# EAGLE design usbio (EAGLE 9.3.0)
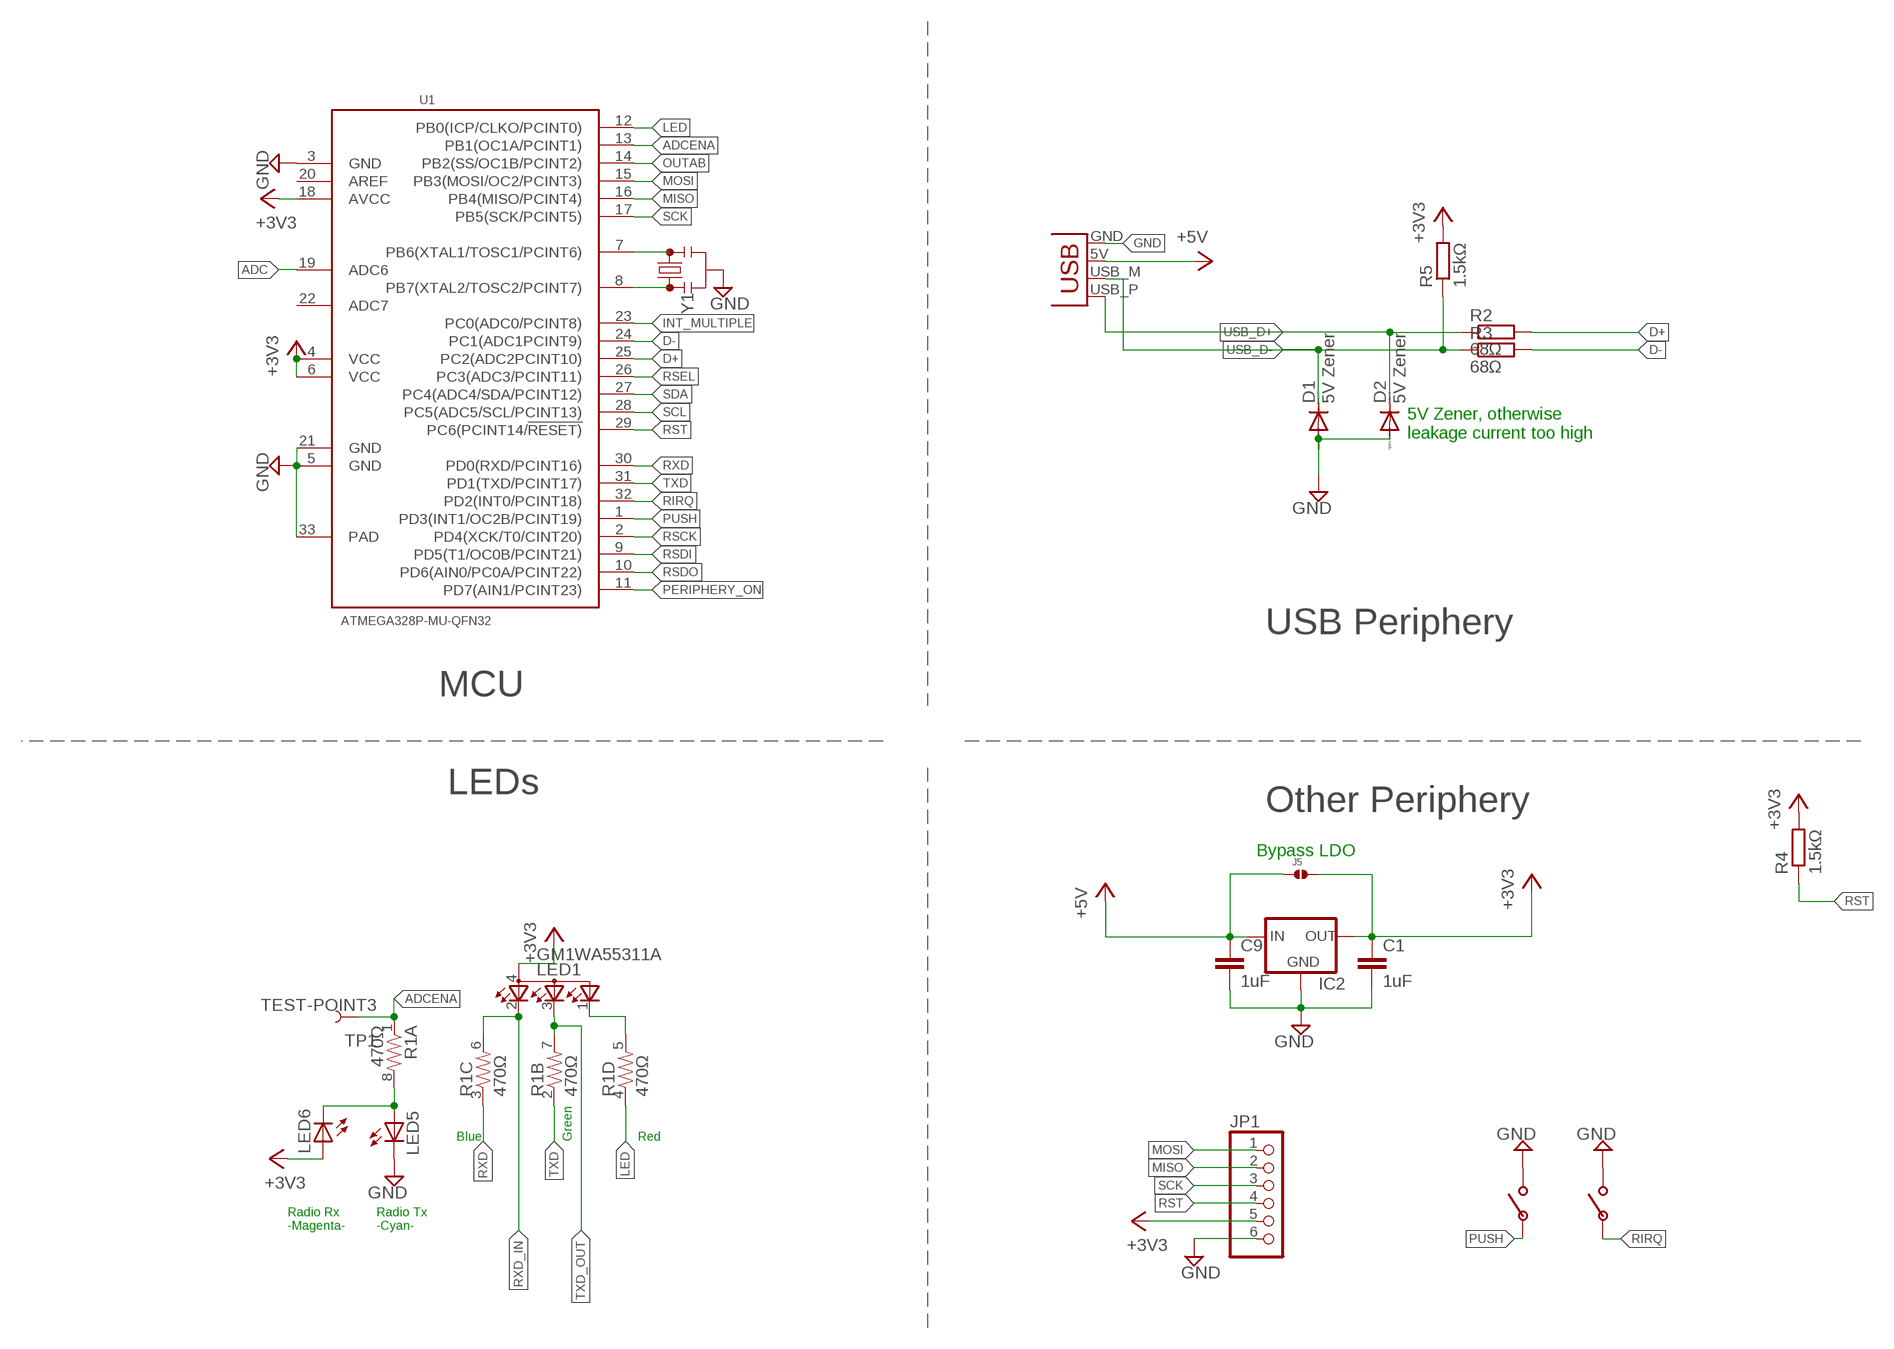
[diagram p0: schematic, sheet 1]

## Parts
C1  1uF  C-EUC0603  [C0603]
C9  1uF  C-EUC0603  [C0603]
D1  5V Zener  DIODE-SOD523  [SOD523]
D2  5V Zener  DIODE-SOD523  [SOD523]
IC2  MCP1700TT  [SOT-23]
J5  SOLDERJUMPER.2.MED  [2.MED]
JP1  PINHD-1X6  [1X06]
JP3  USBPCB  [USB-A-PCB]
LED1  GM1WA55311A  [GM1WA55311A]
LED5  LED0603  [LED-0603]
LED6  LED0603  [LED-0603]
R1  470Ω  RESISTOR-ARRAY0603-ARV  [0603-ARV]
R2  68Ω  R-EU_R0603  [R0603]
R3  68Ω  R-EU_R0603  [R0603]
R4  1.5kΩ  R-EU_R0603  [R0603]
R5  1.5kΩ  R-EU_R0603  [R0603]
TP1  TEST-POINT3  [PAD.03X.03]
U1  ATMEGA328P-MU-QFN32  MCU-ATMEGA328P-MU(QFN32)  [QFN32G-0.5-5X5MM]
U$2  PUSHBUTTON_4X2.5  [PUSHBUTTON_4X2.5]
U$3  PUSHBUTTON_4X2.5  [PUSHBUTTON_4X2.5]
Y1  RESONATORSMD-3.2X1.3  [RESONATOR-SMD-3.2X1.3]

## Nets
+3V3: C1.1 IC2.2(OUT) J5.2 JP1.5 LED1.4(A) LED6.A R4.2 R5.2 U1.4(VCC) U1.6(VCC) U1.18(AVCC)
+5V: C9.1 IC2.3(IN) J5.1 JP3.5V(VBUS)
ADC: U1.19(ADC6)
ADCENA: R1.1 TP1.P$1 U1.13(PB1(OC1A/PCINT1))
D+: R2.2 U1.25(PC2(ADC2PCINT10))
D-: R3.2 U1.24(PC1(ADC1PCINT9))
GND: C1.2 C9.2 D1.A D2.A IC2.1(GND) JP1.6 JP3.GND LED5.C U1.3(GND) U1.5(GND) U1.21(GND) U1.33(PAD) U$2.P$2 U$3.P$2 Y1.2
INT_MULTIPLE: U1.23(PC0(ADC0/PCINT8))
LED: R1.4 U1.12(PB0(ICP/CLKO/PCINT0))
MISO: JP1.2 U1.16(PB4(MISO/PCINT4))
MOSI: JP1.1 U1.15(PB3(MOSI/OC2/PCINT3))
N$6: U1.7(PB6(XTAL1/TOSC1/PCINT6)) Y1.3
N$8: U1.8(PB7(XTAL2/TOSC2/PCINT7)) Y1.1
N$13: LED5.A LED6.C R1.8
N$15: LED1.1(CGREEN) R1.5
OUTAB: U1.14(PB2(SS/OC1B/PCINT2))
PERIPHERY_ON: U1.11(PD7(AIN1/PCINT23))
PUSH: U1.1(PD3(INT1/OC2B/PCINT19)) U$3.P$1
RIRQ: U1.32(PD2(INT0/PCINT18)) U$2.P$1
RSCK: U1.2(PD4(XCK/T0/CINT20))
RSDI: U1.9(PD5(T1/OC0B/PCINT21))
RSDO: U1.10(PD6(AIN0/PC0A/PCINT22))
RSEL: U1.26(PC3(ADC3/PCINT11))
RST: JP1.4 R4.1 U1.29(PC6(PCINT14/!RESET))
RXD: R1.3 U1.30(PD0(RXD/PCINT16))
RXD_IN: LED1.2(CRED) R1.6
SCK: JP1.3 U1.17(PB5(SCK/PCINT5))
SCL: U1.28(PC5(ADC5/SCL/PCINT13))
SDA: U1.27(PC4(ADC4/SDA/PCINT12))
TXD: R1.2 U1.31(PD1(TXD/PCINT17))
TXD_OUT: LED1.3(CBLUE) R1.7
USB_D+: D2.C JP3.USB_P(D+) R2.1
USB_D-: D1.C JP3.USB_M(D-) R3.1 R5.1
Unconnected: U1.20(AREF) U1.22(ADC7)

## Notes on the sheet
- 5V Zener, otherwise 
  leakage current too high
- USB Periphery
- MCU
- LEDs
- Other Periphery
- Bypass LDO
- Blue | Green | Red
- Radio Rx
  -Magenta-
- Radio Tx
  -Cyan-

## Library data of the parts
C1 C9 = rcl:C-EU: CAPACITOR, European symbol
D1 D2 = diode:DIODE-: DIODE
IC2 = MCP1700:MCP1700: Microchip MCP1700 positive regulator
J5 = solderjumper:SOLDERJUMPER.2
JP1 = adafruit:PINHD-1X6: PIN HEADER
JP3 = Spark:USB
LED1 = led:GM1WA55311A: Chip LED RGB Source: http://document.sharpsma.com/files/GM1WA55311A_SS.pdf
LED5 LED6 = SparkFun:LED: LEDs Standard schematic elements and footprints for 5mm, 3mm, 1206, and 0603 sized LEDs. 5mm - Spark Fun Electronics SKU : COM-00529 (and others)
R1 = SparkFun:RESISTOR-ARRAY: Array Chip Resistor Source: RS Component / Phycomp
R2-R5 = rcl:R-EU_: RESISTOR, European symbol
TP1 = SparkFun:TEST-POINT
U1 = Seeed-OPL-ic:MCU-ATMEGA328P-MU(QFN32): 310010005; MPN: ATMEGA328P-MU
U$2 U$3 = pusbbutton_4x2_5:PUSHBUTTON_4X2.5
Y1 = SparkFun-Clocks:RESONATOR: Resonators (Generic) Ceramic resonators are clock-generating components, often used to control timing in microcontrollers. They usually have 3 pins: two pins for oscillation, and one pin for ground. Compared to crystals, resonators have worse tolerance, but are usually much cheaper. Plus, they have built-in load capacitors! These devices are used on boards like the Arduino Pro 8MHz <https://www.sparkfun.com/products/11114> and Arduino Pro 16MHz <https://www.sparkfun.com/products/11113>.

## Board
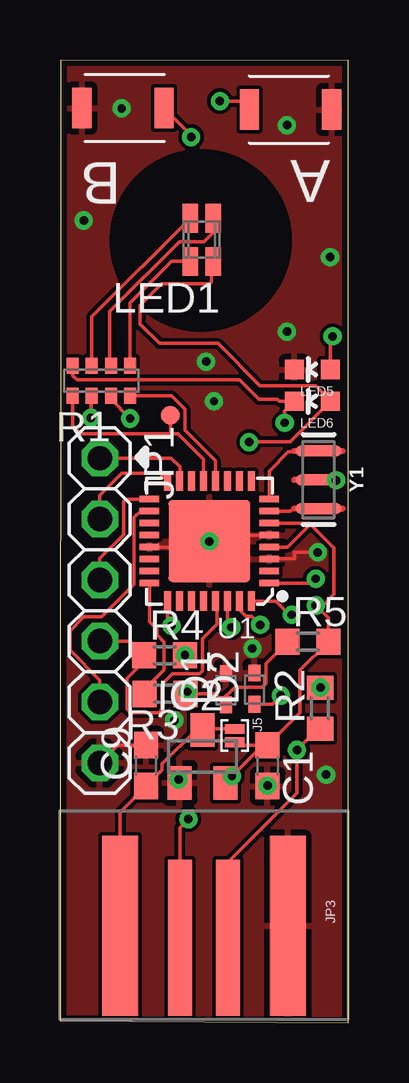
[diagram p1: board, top side]
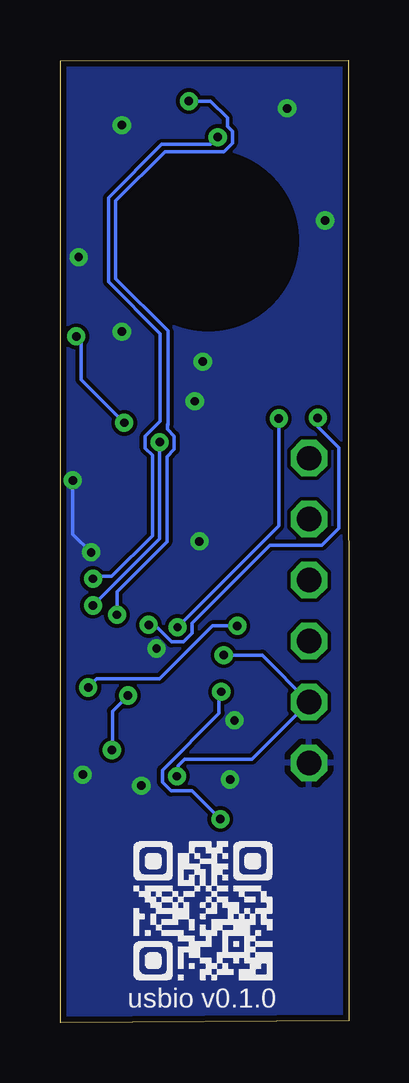
[diagram p2: board, bottom side, seen from below]

Size 12.02 x 40.12 mm. Coordinates in mm from the lower left corner, seen from the top.
Outline: 0,0.08 12.02,0 12.02,40.09 0.03,40.12 0,0.08
Copper layers (1*16): Top 0.035mm / dielectric 1.5mm / Bottom 0.035mm
Design rules "default *": minimum track width 6mil, minimum drill 0.35mm, track to track 6mil, track to pad 6mil, pad to pad 6mil, via to via 6mil, smd to smd 6mil, copper to edge 10mil, drill to drill 6mil, minimum pad ring 10mil, minimum via ring 8mil, stop-mask expansion 4mil, vias tented up to drill 0mil, thermal gap 10mil
tKeepout: area 2.2,28.9 to 9.6,36.3
bKeepout: area 2.2,28.9 to 9.6,36.3
tRestrict: area 2.2,28.9 to 9.6,36.3
bRestrict: area 2.2,28.9 to 9.6,36.3

### Footprints (pad centres in the part's own frame; a part is rotated, then mirrored left to right if it is on the bottom)
C0603 = smd 1.1 x 1: 1 -0.85,0; 2 0.85,0
SOD523 = smd 0.7 x 0.5: A 0.7,0; C -0.6,0
SOT-23 = smd 1 x 1.4: 1 -0.95,-1.1; 2 0.95,-1.1; 3 0,1.1
2.MED = smd 0.406 x 0.813: 1 -0.279,0; 2 0.279,0
1X06 = drill 1.016 octagon: 1 -6.35,0; 2 -3.81,0; 3 -1.27,0; 4 1.27,0; 5 3.81,0; 6 6.35,0
USB-A-PCB = smd 7.5 x 1.5: 5V -0.2,-3.5; GND -0.2,3.5 | smd 6.5 x 1: USB_M 0.3,-1; USB_P 0.3,1
GM1WA55311A = smd 0.65 x 1.2: 1 0.477,0.9; 2 -0.475,-0.9; 3 0.475,-0.9; 4 -0.477,0.9
LED-0603 = smd 0.8 x 0.8: A 0,-0.75; C 0,0.75
0603-ARV = smd 0.5 x 0.65: 1 -1.2,-0.625; 2 -0.4,-0.625; 3 0.4,-0.625; 4 1.2,-0.625; 5 1.2,0.625; 6 0.4,0.625; 7 -0.4,0.625; 8 -1.2,0.625
R0603 = smd 1 x 1.1: 1 -0.85,0; 2 0.85,0
PAD.03X.03 = smd 0.762 x 0.762: P$1 0,0
QFN32G-0.5-5X5MM = smd 0.813 x 0.279: 1 -2.5,1.75; 2 -2.5,1.25; 3 -2.5,0.75; 4 -2.5,0.25; 5 -2.5,-0.25; 6 -2.5,-0.75; 7 -2.5,-1.25; 8 -2.5,-1.75; 17 2.5,-1.75; 18 2.5,-1.25; 19 2.5,-0.75; 20 2.5,-0.25; 21 2.5,0.25; 22 2.5,0.75; 23 2.5,1.25; 24 2.5,1.75 | smd 0.279 x 0.813: 9 -1.75,-2.5; 10 -1.25,-2.5; 11 -0.75,-2.5; 12 -0.25,-2.5; 13 0.25,-2.5; 14 0.75,-2.5; 15 1.25,-2.5; 16 1.75,-2.5; 25 1.75,2.5; 26 1.25,2.5; 27 0.75,2.5; 28 0.25,2.5; 29 -0.25,2.5; 30 -0.75,2.5; 31 -1.25,2.5; 32 -1.75,2.5 | smd 3.429 x 3.429: 33 0,0
PUSHBUTTON_4X2.5 = smd 0.8 x 1.7: P$1 -1.27,0; P$2 2.159,0
RESONATOR-SMD-3.2X1.3 = smd 0.45 x 1.905: 1 -1.2,0; 2 0,0; 3 1.2,0

### Placement (x,y rotation side)
C1  8.66,10.72 270 top
C9  3.6,10.72 90 top
D1  6.92,13.86 90 top
D2  8.11,13.88 90 top
IC2  5.95,11.1 0 top
J5  7.29,11.96 270 top
JP1  1.66,17.18 270 top
JP3  6.01,3.84 270 top
LED1  5.91,32.62 180 top
LED5  10.53,27.22 90 top
LED6  10.53,25.89 90 top
R1  1.73,26.75 0 top
R2  10.85,13.11 90 top
R3  4.38,13.7 180 top
R4  4.37,15.32 0 top
R5  10.34,15.88 0 top
TP1  4.6,25.32 0 top
U1  6.24,20.07 180 top
U$2  9.17,38.05 0 top
U$3  3.08,38.12 180 top
Y1  10.79,22.63 270 top

### Tracks (layer width: path | path; a pad name or v marks a point on that pad's centre or on a via)
+3V3  (via drill 0.35)
  Top 0.152: 10.87,15.88 R5.2 | IC2.2 v7.18,10.28 8.47,11.57 C1.1 | C1.1 10.02,12.93 10.02,14.68 11.19,15.86 R5.2 | v7.89,24.19 7.92,24.22 9.61,24.22 LED6.A 11.28,25.95 10.68,26.55 8.34,26.55 6.58,28.31 4.15,28.31 3.35,29.11 3.35,29.9 4.24,30.79 6.22,30.79 6.33,30.89 6.33,31.66 LED1.4 | v10.67,17.39 10.74,17.32 | 10.74,17.32 11.19,16.87 R5.2 | U1.6 10.39,20.82 10.44,20.78 | 10.44,20.78 11.43,19.79 11.43,17.85 10.9,17.32 10.74,17.32 | U1.18 3.36,21.32 3.1,21.06 3.1,18.28 1.74,16.92 1,16.92 0.42,16.34 0.42,15.52 1.66,14.28 JP1.5 | U1.4 9.48,19.82 10.44,20.78 | J5.2 7.41,11.57 C1.1 | R4.2 5.22,15.58 5.26,15.62 5.26,15.36 R4.2
  Bottom 0.152: v7.18,10.28 7.14,10.32 7.14,10.72 6.87,10.99 4.04,10.99 JP1.5 3.62,15.32 R4.2 | v7.89,24.19 7.89,20.17 v10.67,17.39
  other vias: 5.22,15.32
+5V
  Top 0.152: JP3.5V 2.51,8.78 C9.1 4.27,10.54 4.27,10.79 5.67,12.2 IC2.3 5.99,12.24 J5.1
ADCENA
  Top 0.152: 5.98,22.95 U1.13 5.99,23.48 4.92,24.54 4.67,24.54 | 4.6,25.48 TP1.P$1 4.6,24.61 4.67,24.54 | R1.1 0.53,24.87 0.86,24.54 4.67,24.54
D+  (via drill 0.35)
  Top 0.152: 4.54,17.51 U1.25 4.49,16.71 v4.65,16.54 | v10.87,13.97 10.86,13.96 R2.2
  Bottom 0.152: v4.65,16.54 5.7,16.54 7.9,14.34 10.52,14.34 10.87,13.99 10.87,13.98 v10.87,13.97
D-
  Top 0.152: R3.2 3.44,13.8 | 3.44,13.8 3.15,14.08 | 3.71,18.3 U1.24 3.74,16.71 4.05,16.4 4.05,16.16 4.35,15.86 4.35,14.71 3.44,13.8
GND  (via drill 0.35)
  Top 0.152: U1.3 8.75,19.33 9.78,19.33 9.78,19.6 v10.75,19.6 | U1.21 5.99,19.82 U1.33 6.49,20.32 U1.5 | Y1.2 11.29,22.63 11.32,22.6 v11.52,22.6 | JP1.6 2.41,11.57 C9.2
  Bottom 0.152: v11.52,22.6 11.52,20.37 v10.75,19.6
  other vias: 11.1,10.34 11.27,31.9 9.47,28.8 6.1,27.55 0.99,33.43 9.47,37.4 2.57,38.1 4.77,12.6 6.24,20.06 4.95,10.14 6.43,25.9 8.02,15.6 8.66,9.88
  pour Top: 12.07,0.1 12.07,40 -0.03,40 -0.03,0.1
  pour Bottom: -0.03,0.1 12.07,0.1 12.07,40 -0.03,40
LED
  Top 0.152: R1.4 4.66,26.13 5.21,25.57 5.21,24.68 6.49,23.41 U1.12
MISO
  Top 0.152: U1.16 4.16,22.9 2.58,22.9 1.66,21.98 JP1.2
MOSI
  Top 0.152: JP1.1 4.64,23.53 5,23.17 5,22.59 U1.15
N$6
  Top 0.152: 10.76,21.45 Y1.3 9.72,21.43 9.61,21.32 U1.7
N$8
  Top 0.152: 8.67,21.88 U1.8 8.74,22.99 9.54,23.79 10.75,23.79 Y1.1
N$13  (via drill 0.35)
  Top 0.152: R1.8 0.53,26.96 0.71,26.79 7.5,26.79 8.31,25.98 9.08,25.98 9.16,25.89 LED6.C 9.37,25.49 v9.37,25 | v11.37,28.6 11.28,28.51 LED5.A
  Bottom 0.152: v9.37,25 11.17,26.8 11.17,28.5 11.37,28.7 v11.37,28.6
N$15
  Top 0.152: LED1.1 4.65,31.72 2.93,30 R1.5
PUSH  (via drill 0.35)
  Top 0.152: U1.1 10.49,18.32 v10.67,18.5 | v5.47,36.9 5.47,36.99 U$3.P$1
  Bottom 0.152: v10.67,18.5 10.57,18.6 9.89,18.6 8.2,20.3 8.2,23.64 8.5,23.94 8.5,24.44 7.87,25.07 7.87,28.72 10.03,30.88 10.03,34.37 7.81,36.6 5.78,36.6 v5.47,36.9
RIRQ  (via drill 0.35)
  Top 0.152: U1.32 9,17.57 9.57,17 v9.67,17 | v6.67,38.4 7.56,38.4 U$2.P$1
  Bottom 0.152: v9.67,17 9.67,17.96 7.59,20.04 7.59,23.59 7.29,23.89 7.29,24.44 7.57,24.73 7.57,24.9 | v6.67,38.4 5.77,38.4 5.07,37.7 5.07,37.36 4.87,37.15 4.87,36.65 5.22,36.29 7.68,36.29 9.73,34.25 9.73,31.01 7.55,28.83 7.55,24.93 7.57,24.9 | 7.57,24.94 7.57,24.9
RST
  Top 0.152: U1.29 6.46,17.55 6.54,17.46 6.54,16.61 5.95,16.01 5.95,14.67 5.81,14.54 4.7,14.54 4.26,14.1 4.26,13.06 4.13,12.92 2.94,12.92 2.8,13.06 2.8,14.35 3.52,15.06 R4.1 2.93,15.91 JP1.4
RXD  (via drill 0.35)
  Top 0.152: U1.30 6.99,16.57 7.08,16.47 7.09,16.48 v7.15,16.48 | v2.92,25.18 2.13,25.97 R1.3
  Bottom 0.152: v7.15,16.48 2.92,20.71 v2.92,25.18
RXD_IN
  Top 0.152: LED1.2 6.39,32.92 6.02,32.55 4.98,32.55 2.07,29.64 2.07,27.44 R1.6
SCK
  Top 0.152: U1.17 2.74,21.82 2.66,21.74 2.66,20.34 1.66,19.35 JP1.3
TXD  (via drill 0.35)
  Top 0.152: R1.2 1.3,26.1 v1.3,25.21 | v8.35,16.58 7.99,16.94 7.75,16.94 7.49,17.2 U1.31
  Bottom 0.152: v1.3,25.21 1.3,24.84 0.42,23.96 0.42,20.6 1.12,19.9 3.3,19.9 6.54,16.66 6.54,16.49 6.54,16.23 6.9,15.88 7.4,15.88 8.1,16.58 v8.35,16.58 8.43,16.58 8.57,16.44
TXD_OUT
  Top 0.152: LED1.3 1.33,29.42 R1.7
USB_D+  (via drill 0.35)
  Top 0.152: 10.81,12.23 R2.1 10.78,12.26 v9.89,11.37 9.89,9.56 6.97,6.64 6.97,6.08 7.01,6.04 7.01,4.07 | 8.18,13.21 D2.C 8.86,13.28 v9.21,13.64 | 7.03,4.16 6.97,4.11 7.01,4.07 | 7.01,4.07 JP3.USB_P
  Bottom 0.152: v9.21,13.64 9.86,12.99 9.86,11.37 v9.89,11.37
USB_D-  (via drill 0.35)
  Top 0.152: 5.11,3.64 JP3.USB_M 5.01,8.13 v5.36,8.49 | 6.75,13.43 6.48,13.7 R3.1 v5.32,13.79 | 6.75,13.43 D1.C | R5.1 8.59,14.97 8.59,14.13 8.43,13.98 7.3,13.98 6.75,13.43
  Bottom 0.152: v5.36,8.49 6.54,9.67 7.43,9.67 7.78,10.02 7.78,10.53 5.41,12.9 5.41,13.71 v5.32,13.79

### Text on the board
tPlace: B | A
bPlace: usbio v0.1.0